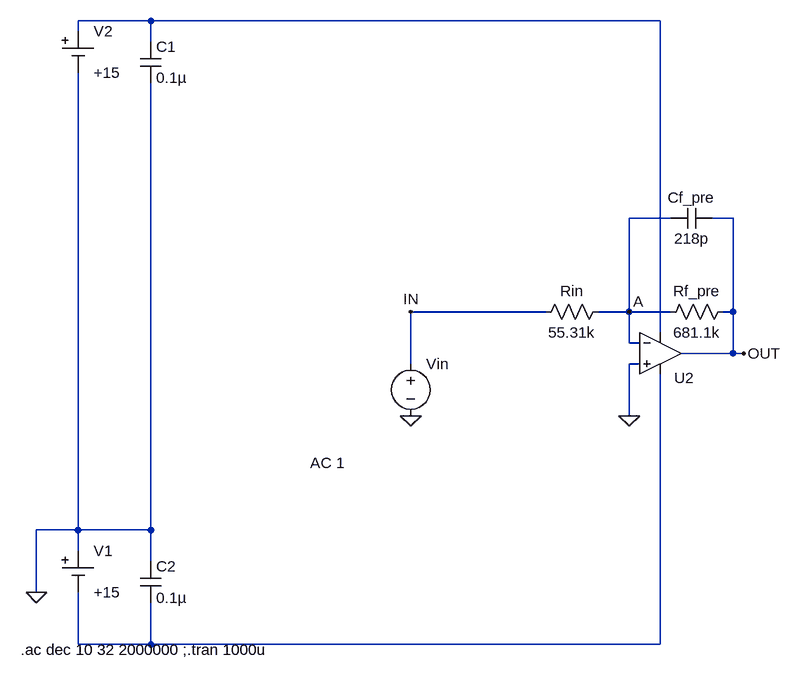
[diagram p0: schematic Circ_1.asc]
Circ_1.asc, the LTspice schematic file:
Version 4
SHEET 1 880 680
WIRE -432 -624 -544 -624
WIRE 352 -624 -432 -624
WIRE -544 -608 -544 -624
WIRE -432 -592 -432 -624
WIRE 368 -320 304 -320
WIRE 464 -320 432 -320
WIRE 176 -176 -32 -176
WIRE 304 -176 304 -320
WIRE 304 -176 256 -176
WIRE 368 -176 304 -176
WIRE 464 -176 464 -320
WIRE 464 -176 448 -176
WIRE 352 -144 352 -624
WIRE 304 -128 304 -176
WIRE 320 -128 304 -128
WIRE 464 -112 464 -176
WIRE 464 -112 384 -112
WIRE 480 -112 464 -112
WIRE -32 -96 -32 -176
WIRE 320 -96 304 -96
WIRE 304 -16 304 -96
WIRE -544 160 -544 -544
WIRE -544 160 -608 160
WIRE -432 160 -432 -528
WIRE -432 160 -544 160
WIRE -544 192 -544 160
WIRE -432 208 -432 160
WIRE -608 256 -608 160
WIRE -544 336 -544 256
WIRE -432 336 -432 272
WIRE -432 336 -544 336
WIRE 352 336 352 -80
WIRE 352 336 -432 336
FLAG 304 -16 0
FLAG -608 256 0
FLAG 480 -112 OUT
FLAG -32 -16 0
FLAG 304 -176 A
FLAG -32 -176 IN
SYMBOL cap -448 208 R0
SYMATTR InstName C2
SYMATTR Value 0.1µ
SYMBOL Misc\\cell -544 192 R0
WINDOW 123 0 0 Left 0
WINDOW 39 0 0 Left 0
SYMATTR InstName V1
SYMATTR Value +15
SYMBOL Misc\\cell -544 -608 R0
WINDOW 123 0 0 Left 0
WINDOW 39 0 0 Left 0
SYMATTR InstName V2
SYMATTR Value +15
SYMBOL res 160 -160 R270
WINDOW 0 32 56 VTop 2
WINDOW 3 0 56 VBottom 2
SYMATTR InstName Rin
SYMATTR Value 55.31k
SYMBOL res 464 -192 R90
WINDOW 0 0 56 VBottom 2
WINDOW 3 32 56 VTop 2
SYMATTR InstName Rf_pre
SYMATTR Value 681.1k
SYMBOL cap -448 -592 R0
SYMATTR InstName C1
SYMATTR Value 0.1µ
SYMBOL Opamps/UniversalOpamp2 352 -112 R0
WINDOW 0 21 38 Left 2
SYMATTR InstName U2
SYMBOL voltage -32 -112 R0
WINDOW 123 -155 169 Left 2
WINDOW 39 0 0 Left 0
WINDOW 3 -155 141 Left 2
SYMATTR Value2 AC 1
SYMATTR Value ""
SYMATTR InstName Vin
SYMBOL cap 432 -336 R90
WINDOW 0 0 32 VBottom 2
WINDOW 3 32 32 VTop 2
SYMATTR InstName Cf_pre
SYMATTR Value 218p
TEXT -632 344 Left 2 !.ac dec 10 32 2000000 ;.tran 1000u

The netlist it stands for:
* Circ_1.asc
C2 0 N002 0.1µ
V1 0 N002 +15
V2 N001 0 +15
Rin IN A 55.31k
Rf_pre OUT A 681.1k
C1 N001 0 0.1µ
XU2 0 A N001 N002 OUT level.2 Avol=1Meg GBW=10Meg Slew=10Meg ilimit=25m rail=0 Vos=0 phimargin=45 en=0 enk=0 in=0 ink=0 Rin=500Meg  ; pins IN+ IN- V+ V- OUT
Vin IN 0 AC 1
Cf_pre OUT A 218p
.ac dec 10 32 2000000 ;.tran 1000u
.lib UniversalOpamps2.sub
.backanno
.end